# EAGLE design 16bit Banked Switches (EAGLE 9.6.2)
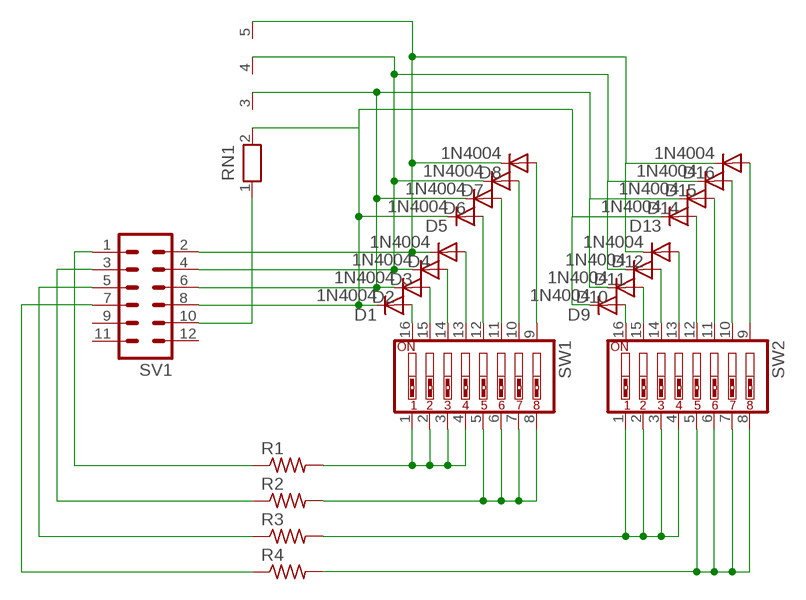
[diagram p0: schematic, sheet 1]

## Parts
D1  1N4004  [DO41-10]
D2  1N4004  [DO41-10]
D3  1N4004  [DO41-10]
D4  1N4004  [DO41-10]
D5  1N4004  [DO41-10]
D6  1N4004  [DO41-10]
D7  1N4004  [DO41-10]
D8  1N4004  [DO41-10]
D9  1N4004  [DO41-10]
D10  1N4004  [DO41-10]
D11  1N4004  [DO41-10]
D12  1N4004  [DO41-10]
D13  1N4004  [DO41-10]
D14  1N4004  [DO41-10]
D15  1N4004  [DO41-10]
D16  1N4004  [DO41-10]
R1  R-US_0207/9  [0207/9]
R2  R-US_0207/9  [0207/9]
R3  R-US_0207/9  [0207/9]
R4  R-US_0207/9  [0207/9]
RN1  RN04  [RN-5]
SV1  MA06-2  [MA06-2]
SW1  SW_DIP-8  [EDG-08]
SW2  SW_DIP-8  [EDG-08]

## Nets
N$1: R1.2 SW1.1 SW1.2 SW1.3 SW1.4
N$2: R2.2 SW1.5 SW1.6 SW1.7 SW1.8
N$3: R3.2 SW2.1 SW2.2 SW2.3 SW2.4
N$4: R4.2 SW2.5 SW2.6 SW2.7 SW2.8
N$5: D4.C D8.C D12.C D16.C RN1.5 SV1.2
N$6: D1.A SW1.16
N$7: D2.A SW1.15
N$8: D3.A SW1.14
N$9: D4.A SW1.13
N$10: D5.A SW1.12
N$11: D6.A SW1.11
N$12: D7.A SW1.10
N$13: D8.A SW1.9
N$14: D9.A SW2.16
N$15: D10.A SW2.15
N$16: D11.A SW2.14
N$17: D12.A SW2.13
N$18: D13.A SW2.12
N$19: D14.A SW2.11
N$20: D15.A SW2.10
N$21: D16.A SW2.9
N$22: D1.C D5.C D9.C D13.C RN1.2 SV1.8
N$23: D2.C D6.C D10.C D14.C RN1.3 SV1.6
N$24: D3.C D7.C D11.C D15.C RN1.4 SV1.4
N$25: R1.1 SV1.1
N$26: RN1.1 SV1.10
N$27: R2.1 SV1.3
N$28: R3.1 SV1.5
N$29: R4.1 SV1.7
Unconnected: SV1.9 SV1.11 SV1.12

## Library data of the parts
D1-D16 = adafruit:1N4004: DIODE General purpose 1N400x type rectifier (With bigger pads) http://www.ladyada.net/library/pcb/eaglelibrary.html
R1-R4 = adafruit:R-US_: RESISTOR, American symbol
RN1 = resistor-net:RN04: RESISTOR NETWORK; OC_FARNELL: unknown; OC_NEWARK: unknown
SV1 = con-lstb:MA06-2: PIN HEADER; OC_FARNELL: unknown; OC_NEWARK: unknown
SW1 SW2 = special:SW_DIP-8: DIP SWITCH

## Board
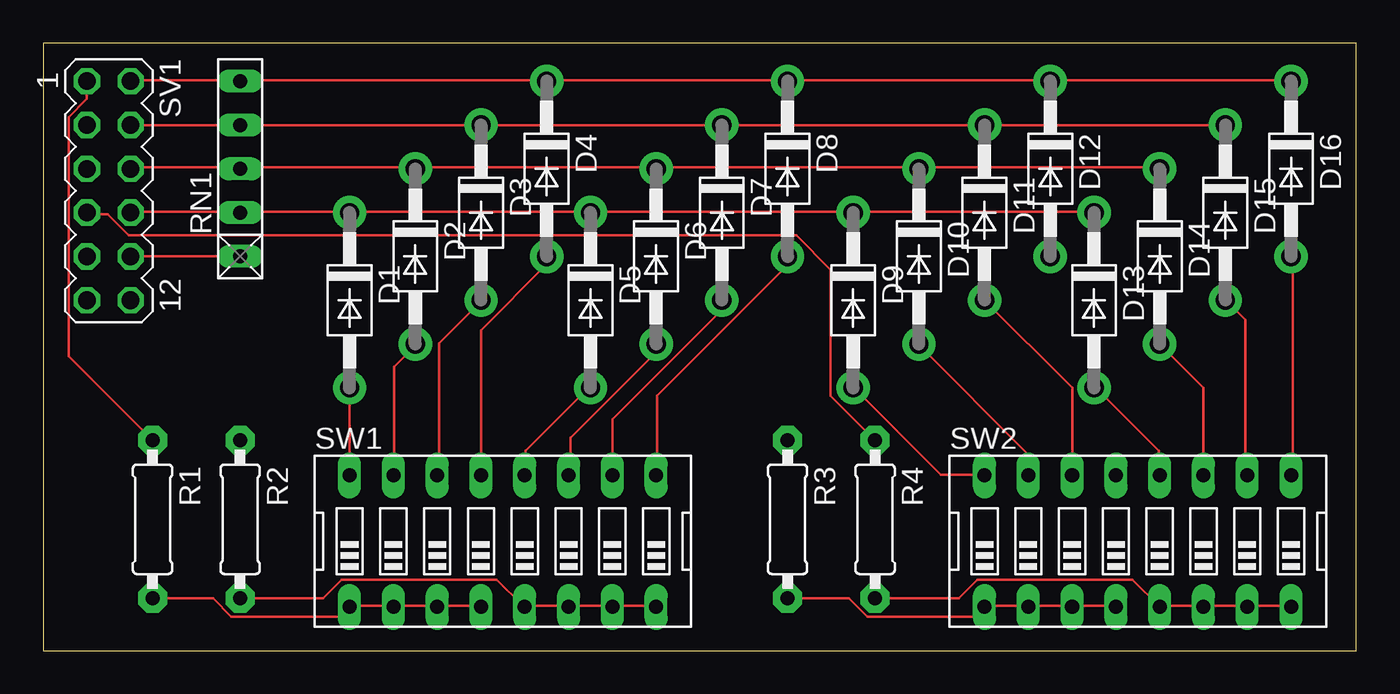
[diagram p1: board, top side]
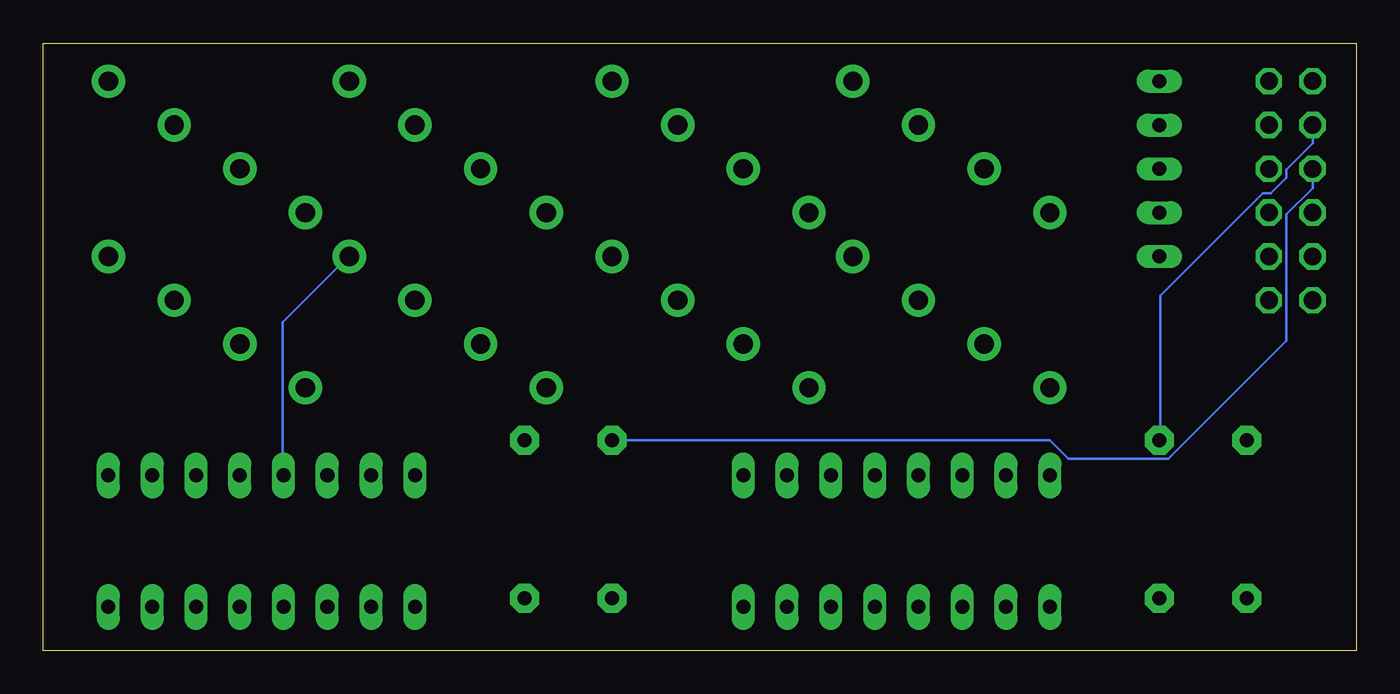
[diagram p2: board, bottom side, seen from below]

Size 76.18 x 35.23 mm. Coordinates in mm from the lower left corner, seen from the top.
Outline: 0,0 76.18,0 76.18,35.23 0,35.23 0,0
Copper layers (1*16): Top 0.035mm / dielectric 1.5mm / Bottom 0.035mm
Design rules "default": minimum track width 6mil, minimum drill 0.35mm, track to track 6mil, track to pad 6mil, pad to pad 6mil, via to via 6mil, smd to smd 6mil, copper to edge 40mil, drill to drill 6mil, minimum pad ring 10mil, minimum via ring 8mil, stop-mask expansion 4mil, vias tented up to drill 0mil, thermal gap 10mil

### Footprints (pad centres in the part's own frame; a part is rotated, then mirrored left to right if it is on the bottom)
DO41-10 = drill 1.118 pad 1.93: A 5.08,0; C -5.08,0
0207/9 = drill 0.813 pad 1.676 octagon: 1 -4.572,0; 2 4.572,0
RN-5 = drill 0.813 long: 1 -5.08,0; 2 -2.54,0; 3 0,0; 4 2.54,0; 5 5.08,0
MA06-2 = drill 1.016 octagon: 1 -6.35,-1.27; 2 -6.35,1.27; 3 -3.81,-1.27; 4 -3.81,1.27; 5 -1.27,-1.27; 6 -1.27,1.27; 7 1.27,-1.27; 8 1.27,1.27; 9 3.81,-1.27; 10 3.81,1.27; 11 6.35,-1.27; 12 6.35,1.27
EDG-08 = drill 0.813 long: 1 -8.89,-3.81; 2 -6.35,-3.81; 3 -3.81,-3.81; 4 -1.27,-3.81; 5 1.27,-3.81; 6 3.81,-3.81; 7 6.35,-3.81; 8 8.89,-3.81; 9 8.89,3.81; 10 6.35,3.81; 11 3.81,3.81; 12 1.27,3.81; 13 -1.27,3.81; 14 -3.81,3.81; 15 -6.35,3.81; 16 -8.89,3.81

### Placement (x,y rotation side)
D1  17.78,20.32 270 top
D2  21.59,22.86 270 top
D3  25.4,25.4 270 top
D4  29.21,27.94 270 top
D5  31.75,20.32 270 top
D6  35.56,22.86 270 top
D7  39.37,25.4 270 top
D8  43.18,27.94 270 top
D9  46.99,20.32 270 top
D10  50.8,22.86 270 top
D11  54.61,25.4 270 top
D12  58.42,27.94 270 top
D13  60.96,20.32 270 top
D14  64.77,22.86 270 top
D15  68.58,25.4 270 top
D16  72.39,27.94 270 top
R1  6.35,7.62 270 top
R2  11.43,7.62 270 top
R3  43.18,7.62 270 top
R4  48.26,7.62 270 top
RN1  11.43,27.94 90 top
SV1  3.81,26.67 270 top
SW1  26.67,6.35 0 top
SW2  63.5,6.35 0 top

### Tracks (layer width: path | path; a pad name or v marks a point on that pad's centre or on a via)
N$1
  Top 0.152: SW1.4 25.4,2.59 22.96,2.59 SW1.3 22.81,2.59 20.37,2.59 SW1.2 20.22,2.59 17.78,2.59 SW1.1 17.78,2.44 17.32,1.98 10.92,1.98 9.86,3.05 R1.2
N$2
  Top 0.152: 33.02,2.59 30.58,2.59 SW1.6 30.43,2.59 27.99,2.59 SW1.5 27.84,2.59 26.31,4.12 17.32,4.12 16.26,3.05 R2.2 | 33.02,2.59 35.46,2.59 SW1.8 | 33.02,2.59 SW1.7
N$3
  Top 0.152: 59.69,2.59 57.25,2.59 SW2.2 57.1,2.59 54.66,2.59 SW2.1 54.05,1.98 47.8,1.98 46.74,3.05 R3.2 | 59.69,2.59 62.13,2.59 SW2.4 | 59.69,2.59 SW2.3
N$4
  Top 0.152: SW2.8 72.34,2.59 69.9,2.59 SW2.7 69.75,2.59 67.31,2.59 | 67.31,2.59 64.87,2.59 SW2.5 63.2,4.12 54.2,4.12 53.14,3.05 R4.2 | 67.31,2.59 SW2.6
N$5
  Top 0.152: D16.C 72.34,33.07 58.47,33.07 D12.C 58.32,33.07 43.23,33.07 D8.C 43.08,33.07 29.21,33.07 | SV1.2 5.13,33.07 11.38,33.07 RN1.5 11.53,33.07 29.21,33.07 | 29.21,33.07 D4.C
N$6
  Top 0.152: D1.A SW1.16
N$7
  Top 0.152: SW1.15 20.37,10.21 20.37,16.46 21.59,17.68 D2.A
N$8
  Top 0.152: SW1.14 22.96,10.21 22.96,17.83 25.4,20.27 D3.A
N$9
  Top 0.152: SW1.13 25.4,18.59 29.21,22.4 D4.A
N$10
  Top 0.152: SW1.12 27.99,10.21 27.99,11.58 31.65,15.24 D5.A
N$11
  Top 0.152: SW1.11 30.58,10.21 30.58,12.34 35.46,17.22 35.46,17.68 D6.A
N$12
  Top 0.152: SW1.10 33.02,13.41 39.27,19.66 39.27,20.27 D7.A
N$13
  Top 0.152: SW1.9 35.61,10.21 35.61,14.78 43.08,22.25 43.08,22.86 D8.A
N$14
  Top 0.152: SW2.16 54.51,10.21 52.07,10.21 47.04,15.24 D9.A
N$15
  Top 0.152: SW2.15 57.1,10.21 57.1,11.43 50.85,17.68 D10.A
N$16
  Top 0.152: SW2.14 59.69,15.24 D11.A
N$17
  Bottom 0.152: SW2.13 62.28,10.21 62.28,19.05 58.47,22.86 D12.A
N$18
  Top 0.152: SW2.12 64.72,10.21 64.72,11.58 61.06,15.24 D13.A
N$19
  Top 0.152: SW2.11 67.31,15.24 D14.A
N$20
  Top 0.152: SW2.10 69.75,10.21 69.75,19.2 68.68,20.27 D15.A
N$21
  Top 0.152: SW2.9 72.49,10.21 72.49,22.86 D16.A
N$22
  Top 0.152: D13.C 60.91,25.45 47.04,25.45 D9.C 46.89,25.45 31.8,25.45 D5.C 31.65,25.45 17.78,25.45 | SV1.8 5.13,25.45 11.38,25.45 RN1.2 11.53,25.45 17.78,25.45 | 17.78,25.45 D1.C
N$23
  Top 0.152: D14.C 64.72,28.04 50.85,28.04 D10.C 50.7,28.04 35.61,28.04 D6.C 35.46,28.04 21.59,28.04 | SV1.6 5.13,28.04 11.38,28.04 RN1.3 11.53,28.04 21.59,28.04 | 21.59,28.04 D2.C
N$24
  Top 0.152: D15.C D11.C D7.C D3.C RN1.4 SV1.4
N$25
  Top 0.152: SV1.1 2.54,32 1.47,30.94 1.47,17.07 R1.1
N$26
  Top 0.152: SV1.10 RN1.1
N$27
  Bottom 0.152: SV1.3 2.54,29.41 4.06,27.89 4.06,27.43 4.98,26.52 5.44,26.52 11.38,20.57 11.38,12.19 R2.1
N$28
  Bottom 0.152: SV1.5 2.54,26.82 4.06,25.3 4.06,17.98 10.92,11.12 16.71,11.12 17.78,12.19 R3.1
N$29
  Top 0.152: R4.1 45.67,14.78 45.67,22.1 43.69,24.08 4.98,24.08 3.76,25.3 2.54,25.3 SV1.7